# EAGLE design i4screenhsmc (EAGLE 6.6.0)
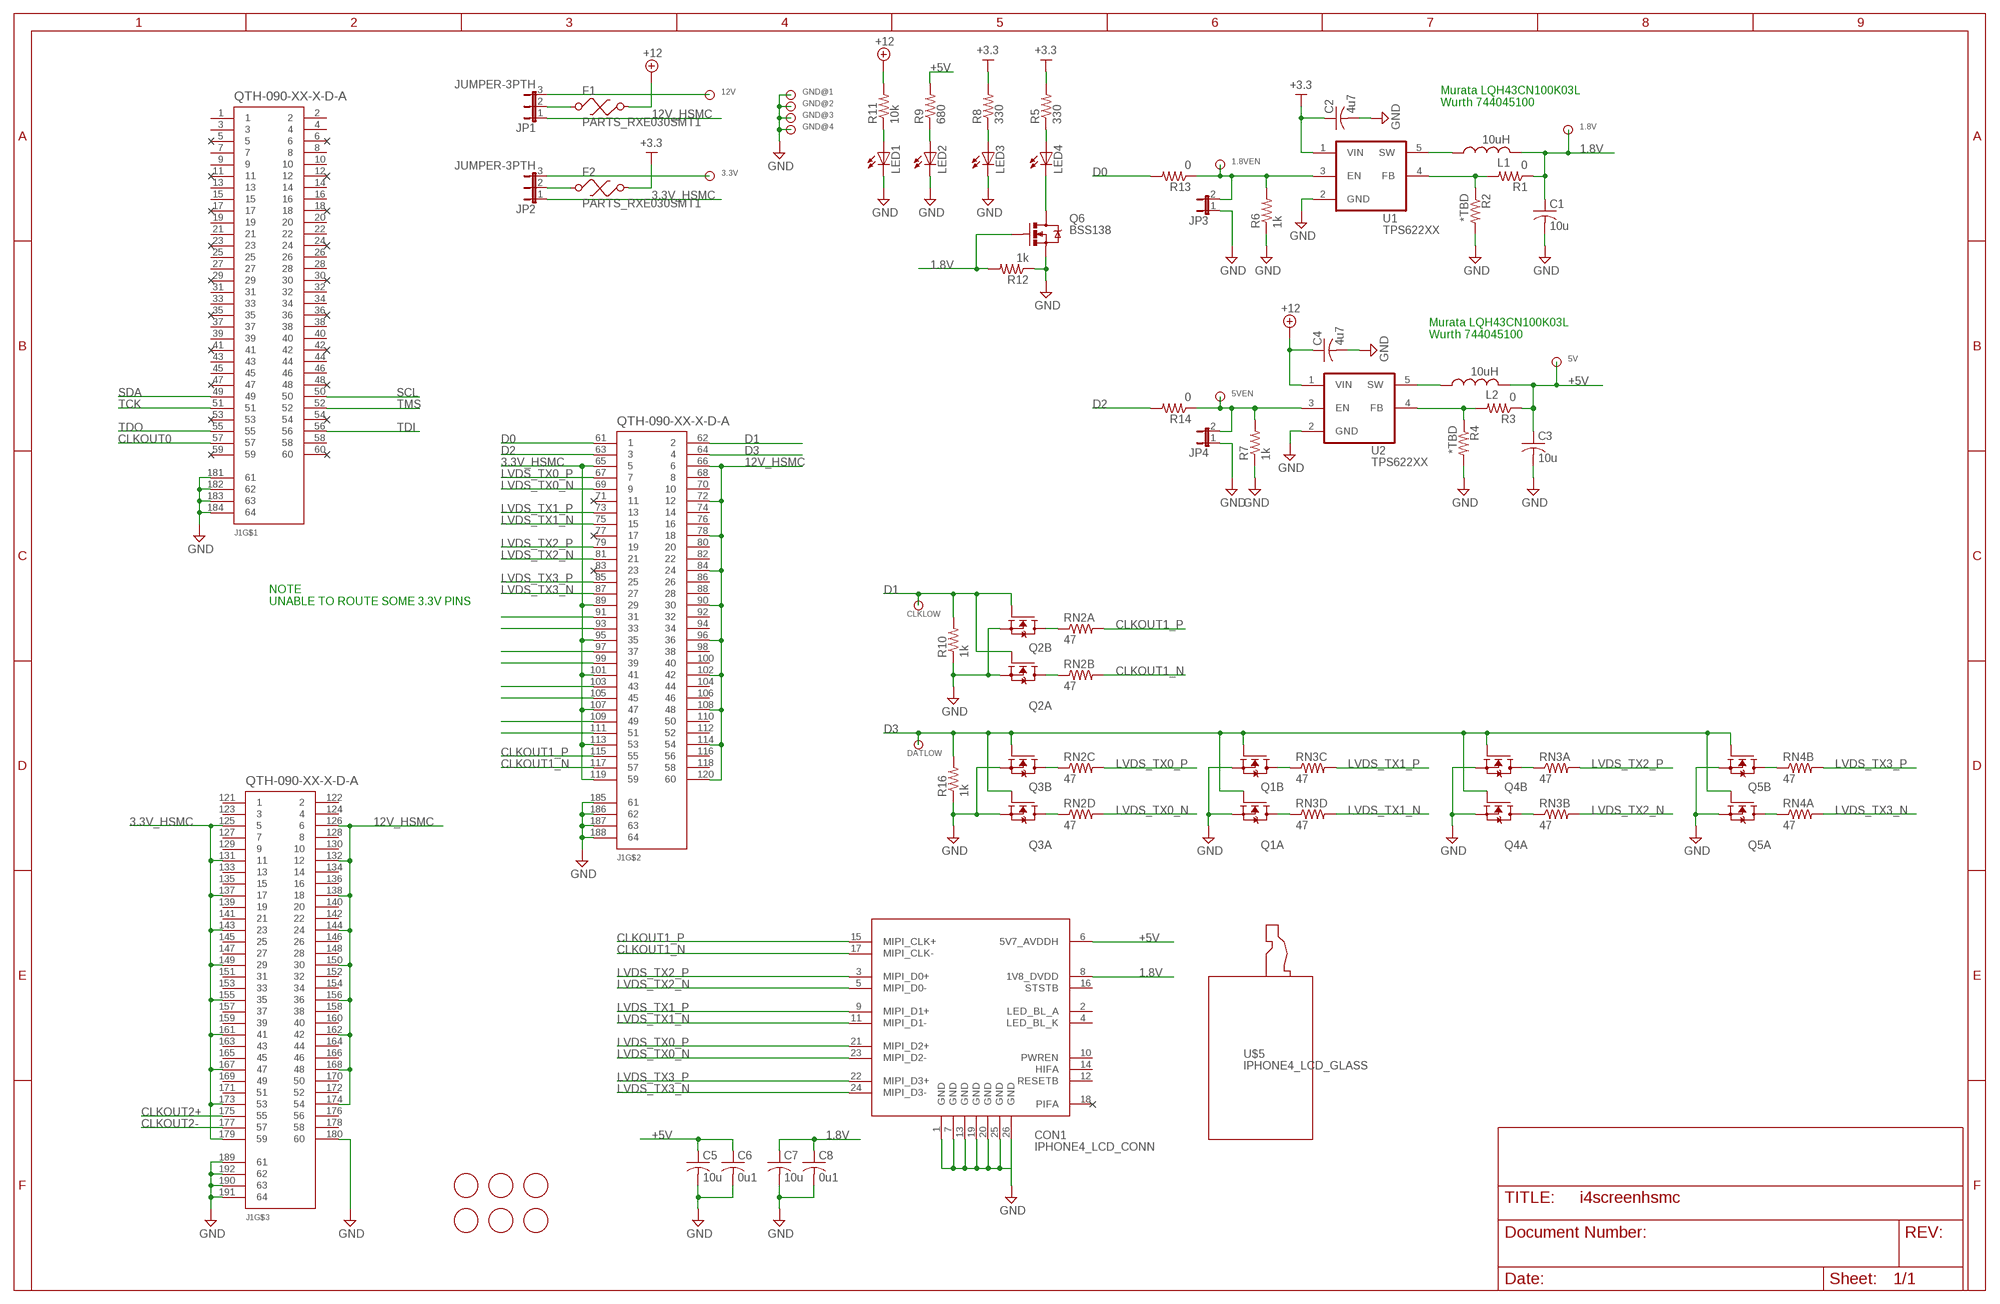
[diagram p0: schematic, sheet 1]

## Parts
1.8V  TESTPOINTKEYSTONE_5015  [5015]
1.8VEN  TESTPOINTKEYSTONE_5016  [5016]
3.3V  TESTPOINTBANANA_JACK  [BANANA_JACK]
5V  TESTPOINTKEYSTONE_5015  [5015]
5VEN  TESTPOINTKEYSTONE_5016  [5016]
12V  TESTPOINTBANANA_JACK  [BANANA_JACK]
C1  10u  C-USC0805  [C0805]
C2  4u7  C-USC0805  [C0805]
C3  10u  C-USC0805  [C0805]
C4  4u7  C-USC0805  [C0805]
C5  10u  C-USC0805  [C0805]
C6  0u1  C-USC0805  [C0805]
C7  10u  C-USC0805  [C0805]
C8  0u1  C-USC0805  [C0805]
CLKLOW  TESTPOINTKEYSTONE_5016  [5016]
CON1  IPHONE4_LCD_CONN  [AXE4E26124]
DATLOW  TESTPOINTKEYSTONE_5016  [5016]
F1  PARTS_RXE030SMT1  [POLYSWITCH_SMTSMALL]
F2  PARTS_RXE030SMT1  [POLYSWITCH_SMTSMALL]
GND@1  TESTPOINTBANANA_JACK  [BANANA_JACK]
GND@2  TESTPOINTBANANA_JACK  [BANANA_JACK]
GND@3  TESTPOINTKEYSTONE_5015  [5015]
GND@4  TESTPOINTKEYSTONE_5015  [5015]
J1  QTH-090-XX-X-D-A  [QTH-090-XX-X-D-A]
JP1  JUMPER-3PTH  [1X03]
JP2  JUMPER-3PTH  [1X03]
JP3  JUMPER-2PTH  [1X02]
JP4  JUMPER-2PTH  [1X02]
L1  10uH  L-USL1812  [L1812]
L2  10uH  L-USL1812  [L1812]
LED1  LEDCHIP-LED0805  [CHIP-LED0805]
LED2  LEDCHIP-LED0805  [CHIP-LED0805]
LED3  LEDCHIP-LED0805  [CHIP-LED0805]
LED4  LEDCHIP-LED0805  [CHIP-LED0805]
Q1  2N7002SC70-6  [SC70-6]
Q2  2N7002SC70-6  [SC70-6]
Q3  2N7002SC70-6  [SC70-6]
Q4  2N7002SC70-6  [SC70-6]
Q5  2N7002SC70-6  [SC70-6]
Q6  BSS138  MOSFET-NCHANNELSMD  [SOT23-3]
R1  0  R-US_R0805  [R0805]
R2  *TBD  R-US_R0805  [R0805]
R3  0  R-US_R0805  [R0805]
R4  *TBD  R-US_R0805  [R0805]
R5  330  R-US_R0805  [R0805]
R6  1k  R-US_R0805  [R0805]
R7  1k  R-US_R0805  [R0805]
R8  330  R-US_R0805  [R0805]
R9  680  R-US_R0805  [R0805]
R10  1k  R-US_R0805  [R0805]
R11  10k  R-US_R0805  [R0805]
R12  1k  R-US_R0805  [R0805]
R13  0  R-US_R0805  [R0805]
R14  0  R-US_R0805  [R0805]
R16  1k  R-US_R0805  [R0805]
RN2  47  RES_NETWORK0805  [2008]
RN3  47  RES_NETWORK0805  [2008]
RN4  47  RES_NETWORK0805  [2008]
U1  TPS622XX  [SOT23-5]
U2  TPS622XX  [SOT23-5]
U$1  MOUNTING_HOLE125  [HOLE_MTG_125]
U$2  MOUNTING_HOLE125  [HOLE_MTG_125]
U$3  MOUNTING_HOLE125  [HOLE_MTG_125]
U$4  MOUNTING_HOLE125  [HOLE_MTG_125]
U$5  IPHONE4_LCD_GLASS  [IPHONE4_LCD]
U$48  MOUNTING_HOLE125  [HOLE_MTG_125]
U$49  MOUNTING_HOLE125  [HOLE_MTG_125]

## Nets
1.8V: 1.8V.P$1 C1.1 C7.1 C8.1 CON1.8(1V8_DVDD) L1.2 Q6.1(G) R1.1 R12.2
3.3V_HSMC: J1.65 J1.89 J1.95 J1.101 J1.107 J1.113 J1.119 J1.125 J1.131 J1.137 J1.143 J1.149 J1.155 J1.161 J1.167 J1.173 J1.179 JP2.1
5VEN: 5VEN.P$1 JP4.2 R7.2 R14.1 U2.3(EN)
12V_HSMC: J1.66 J1.72 J1.78 J1.84 J1.90 J1.96 J1.102 J1.108 J1.114 J1.120 J1.126 J1.132 J1.138 J1.144 J1.150 J1.156 J1.162 J1.168 J1.174 JP1.1
+3.3: C2.1 F2.P$2 R5.2 R8.2 U1.1(VIN)
+5V: 5V.P$1 C3.1 C5.1 C6.1 CON1.6(5V7_AVDDH) L2.2 R3.1 R9.2
+12: C4.1 F1.P$2 R11.2 U2.1(VIN)
CLKOUT0: J1.57
CLKOUT1_N [MIPI]: CON1.17(MIPI_CLK-) J1.117 RN2.7
CLKOUT1_P [MIPI]: CON1.15(MIPI_CLK+) J1.115 RN2.8
CLKOUT2+: J1.175
CLKOUT2-: J1.177
D0: J1.61 R13.2
D1: CLKLOW.P$1 J1.62 Q2.2(B:G) Q2.5(A:G) R10.2
D2: J1.63 R14.2
D3: DATLOW.P$1 J1.64 Q1.2(B:G) Q1.5(A:G) Q3.2(B:G) Q3.5(A:G) Q4.2(B:G) Q4.5(A:G) Q5.2(B:G) Q5.5(A:G) R16.2
GND: C1.2 C2.2 C3.2 C4.2 C5.2 C6.2 C7.2 C8.2 CON1.1(GND) CON1.7(GND) CON1.13(GND) CON1.19(GND) CON1.20(GND) CON1.25(GND) CON1.26(GND) GND@1.1 GND@2.1 GND@3.P$1 GND@4.P$1 J1.180 J1.181 J1.182 J1.183 J1.184 J1.185 J1.186 J1.187 J1.188 J1.189 J1.190 J1.191 J1.192 JP3.1 JP4.1 LED1.C LED2.C LED3.C Q1.1(B:S) Q1.4(A:S) Q2.1(B:S) Q2.4(A:S) Q3.1(B:S) Q3.4(A:S) Q4.1(B:S) Q4.4(A:S) Q5.1(B:S) Q5.4(A:S) Q6.2(S) R2.2 R4.2 R6.1 R7.1 R10.1 R12.1 R16.1 U1.2(GND) U2.2(GND)
LVDS_TX0_N [MIPI]: CON1.23(MIPI_D2-) J1.69 RN2.5
LVDS_TX0_P [MIPI]: CON1.21(MIPI_D2+) J1.67 RN2.6
LVDS_TX1_N [MIPI]: CON1.11(MIPI_D1-) J1.75 RN3.5
LVDS_TX1_P [MIPI]: CON1.9(MIPI_D1+) J1.73 RN3.6
LVDS_TX2_N [MIPI]: CON1.5(MIPI_D0-) J1.81 RN3.7
LVDS_TX2_P [MIPI]: CON1.3(MIPI_D0+) J1.79 RN3.8
LVDS_TX3_N [MIPI]: CON1.24(MIPI_D3-) J1.87 RN4.8
LVDS_TX3_P [MIPI]: CON1.22(MIPI_D3+) J1.85 RN4.7
N$1: 1.8VEN.P$1 JP3.2 R6.2 R13.1 U1.3(EN)
N$2: L1.1 U1.5(SW)
N$3 [MIPI]: J1.91
N$4 [MIPI]: J1.93
N$5 [MIPI]: J1.97
N$6 [MIPI]: J1.99
N$7 [MIPI]: J1.103
N$8 [MIPI]: J1.105
N$9 [MIPI]: J1.109
N$10 [MIPI]: J1.111
N$11: L2.1 U2.5(SW)
N$12: LED4.A R5.1
N$13: Q1.6(B:D) RN3.3
N$14: F2.P$1 JP2.2
N$15: Q1.3(A:D) RN3.4
N$16: Q2.6(B:D) RN2.1
N$17: Q2.3(A:D) RN2.2
N$18: Q3.6(B:D) RN2.3
N$19: Q3.3(A:D) RN2.4
N$20: Q4.6(B:D) RN3.1
N$21: Q4.3(A:D) RN3.2
N$22: F1.P$1 JP1.2
N$23: R1.2 R2.1 U1.4(FB)
N$24: Q5.6(B:D) RN4.2
N$25: Q5.3(A:D) RN4.1
N$26: R3.2 R4.1 U2.4(FB)
N$27: 12V.1 JP1.3
N$28: 3.3V.1 JP2.3
N$29: LED3.A R8.1
N$30: LED2.A R9.1
N$31: LED1.A R11.1
N$32: LED4.C Q6.3(D)
SCL: J1.50
SDA: J1.49
TCK: J1.51
TDI: J1.56
TDO: J1.55
TMS: J1.52
Unconnected: CON1.2(LED_BL_A) CON1.4(LED_BL_K) CON1.10(PWREN) CON1.12(RESETB) CON1.14(HIFA) CON1.16(STSTB) CON1.18(PIFA) J1.1 J1.2 J1.3 J1.4 J1.5 J1.6 J1.7 J1.8 J1.9 J1.10 J1.11 J1.12 J1.13 J1.14 J1.15 J1.16 J1.17 J1.18 J1.19 J1.20 J1.21 J1.22 J1.23 J1.24 J1.25 J1.26 J1.27 J1.28 J1.29 J1.30 J1.31 J1.32 J1.33 J1.34 J1.35 J1.36 J1.37 J1.38 J1.39 J1.40 J1.41 J1.42 J1.43 J1.44 J1.45 J1.46 J1.47 J1.48 J1.53 J1.54 J1.58 J1.59 J1.60 J1.68 J1.70 J1.71 J1.74 J1.76 J1.77 J1.80 J1.82 J1.83 J1.86 J1.88 J1.92 J1.94 J1.98 J1.100 J1.104 J1.106 J1.110 J1.112 J1.116 J1.118 J1.121 J1.122 J1.123 J1.124 J1.127 J1.128 J1.129 J1.130 J1.133 J1.134 J1.135 J1.136 J1.139 J1.140 J1.141 J1.142 J1.145 J1.146 J1.147 J1.148 J1.151 J1.152 J1.153 J1.154 J1.157 J1.158 J1.159 J1.160 J1.163 J1.164 J1.165 J1.166 J1.169 J1.170 J1.171 J1.172 J1.176 J1.178 RN4.3 RN4.4 RN4.5 RN4.6

## Notes on the sheet
- Murata LQH43CN100K03L
  Wurth 744045100
- Murata LQH43CN100K03L
  Wurth 744045100
- NOTE
  UNABLE TO ROUTE SOME 3.3V PINS

## Library data of the parts
1.8V 1.8VEN 3.3V 5V 5VEN 12V CLKLOW DATLOW GND@1-GND@4 = ak-misc:TESTPOINT: Various test points
C1-C8 = rcl:C-US: CAPACITOR, American symbol
CON1 = ak-misc:IPHONE4_LCD_CONN
F1 F2 = bipm:PARTS_RXE030
J1 = QTH-090-XX-X-D-A:QTH-090-XX-X-D-A: HIGH SPEED TERMINAL STRIP, .5mm PITCH, 180 PINS. MANUFACTURER:SAMTEC.
JP1 JP2 = SparkFun:JUMPER-3
JP3 JP4 = SparkFun:JUMPER-2: Jumper Basic 0.1" spaced jumper. Use with breakaway headers.
L1 L2 = rcl:L-US: INDUCTOR, American symbol
LED1-LED4 = led:LED: LED OSRAM: - CHIPLED LG R971, LG N971, LY N971, LG Q971, LY Q971, LO R971, LY R971 LH N974, LH R974 LS Q976, LO Q976, LY Q976 LO Q996 - Hyper CHIPLED LW Q18S LB Q993, LB Q99A, LB R99A - SideLED LS A670, LO A670, LY A670, LG A670, LP A670 LB A673, LV A673, LT A673, LW A673 LH A674 LY A675 LS A676, LA A676, LO A676, LY A676, LW A676 LS A679, LY A679, LG A679 - Hyper Micro SIDELED® LS Y876, LA Y876, LO Y876, LY Y876 LT Y87S - SmartLED LW L88C, LW L88S LB L89C, LB L89S, LG L890 LS L89K, LO L89K, LY L89K LS L896, LA L896, LO L896, LY L896 - TOPLED LS T670, LO T670, LY T670, LG T670, LP T670 LSG T670, LSP T670, LSY T670, LOP T670, LYG T670 LG T671, LOG T671, LSG T671 LB T673, LV T673, LT T673, LW T673 LH T674 LS T676, LA T676, LO T676, LY T676, LB T676, LH T676, LSB T676, LW T676 LB T67C, LV T67C, LT T67C, LS T67K, LO T67K, LY T67K, LW E67C LS E67B, LA E67B, LO E67B, LY E67B, LB E67C, LV E67C, LT E67C LW T67C LS T679, LY T679, LG T679 LS T770, LO T770, LY T770, LG T770, LP T770 LB T773, LV T773, LT T773, LW T773 LH T774 LS E675, LA E675, LY E675, LS T675 LS T776, LA T776, LO T776, LY T776, LB T776 LHGB T686 LT T68C, LB T68C - Hyper Mini TOPLED® LB M676 - Mini TOPLED Santana® LG M470 LS M47K, LO M47K, LY M47K Source: http://www.osram.convergy.de LUXEON: - LUMILED® LXK2-PW12-R00, LXK2-PW12-S00, LXK2-PW14-U00, LXK2-PW14-V00 LXK2-PM12-R00, LXK2-PM12-S00, LXK2-PM14-U00 LXK2-PE12-Q00, LXK2-PE12-R00, LXK2-PE12-S00, LXK2-PE14-T00, LXK2-PE14-U00 LXK2-PB12-K00, LXK2-PB12-L00, LXK2-PB12-M00, LXK2-PB14-N00, LXK2-PB14-P00, LXK2-PB14-Q00 LXK2-PR12-L00, LXK2-PR12-M00, LXK2-PR14-Q00, LXK2-PR14-R00 LXK2-PD12-Q00, LXK2-PD12-R00, LXK2-PD12-S00 LXK2-PH12-R00, LXK2-PH12-S00 LXK2-PL12-P00, LXK2-PL12-Q00, LXK2-PL12-R00 Source: www.luxeon.com KINGBRIGHT: KA-3528ASYC Source: www.kingbright.com
Q1-Q5 = ak-misc:2N7002
Q6 = SparkFun:MOSFET-NCHANNEL
R1-R14 R16 = rcl:R-US_: RESISTOR, American symbol
RN2-RN4 = ak-misc:RES_NETWORK
U1 U2 = ak-misc:TPS622XX
U$1-U$4 U$48 U$49 = ak-misc:MOUNTING_HOLE
U$5 = ak-misc:IPHONE4_LCD_GLASS

## Net classes
1 MIPI: width 0.3 mm, drill 0.3 mm, clearance 0.15 mm

## Board
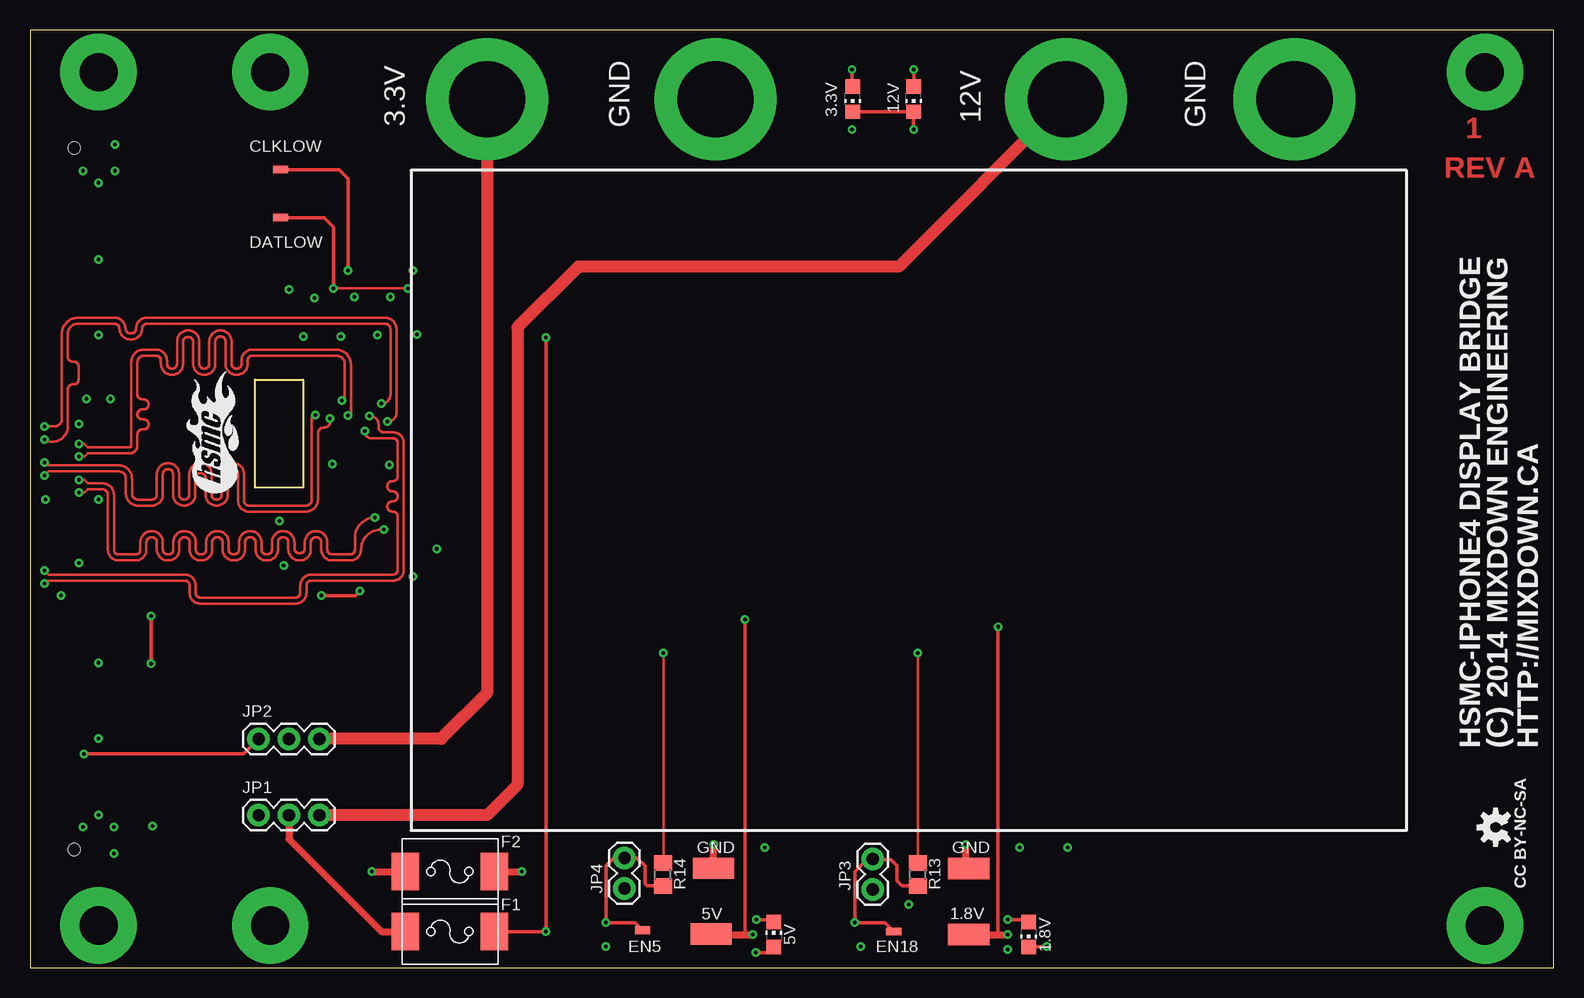
[diagram p1: board, top side]
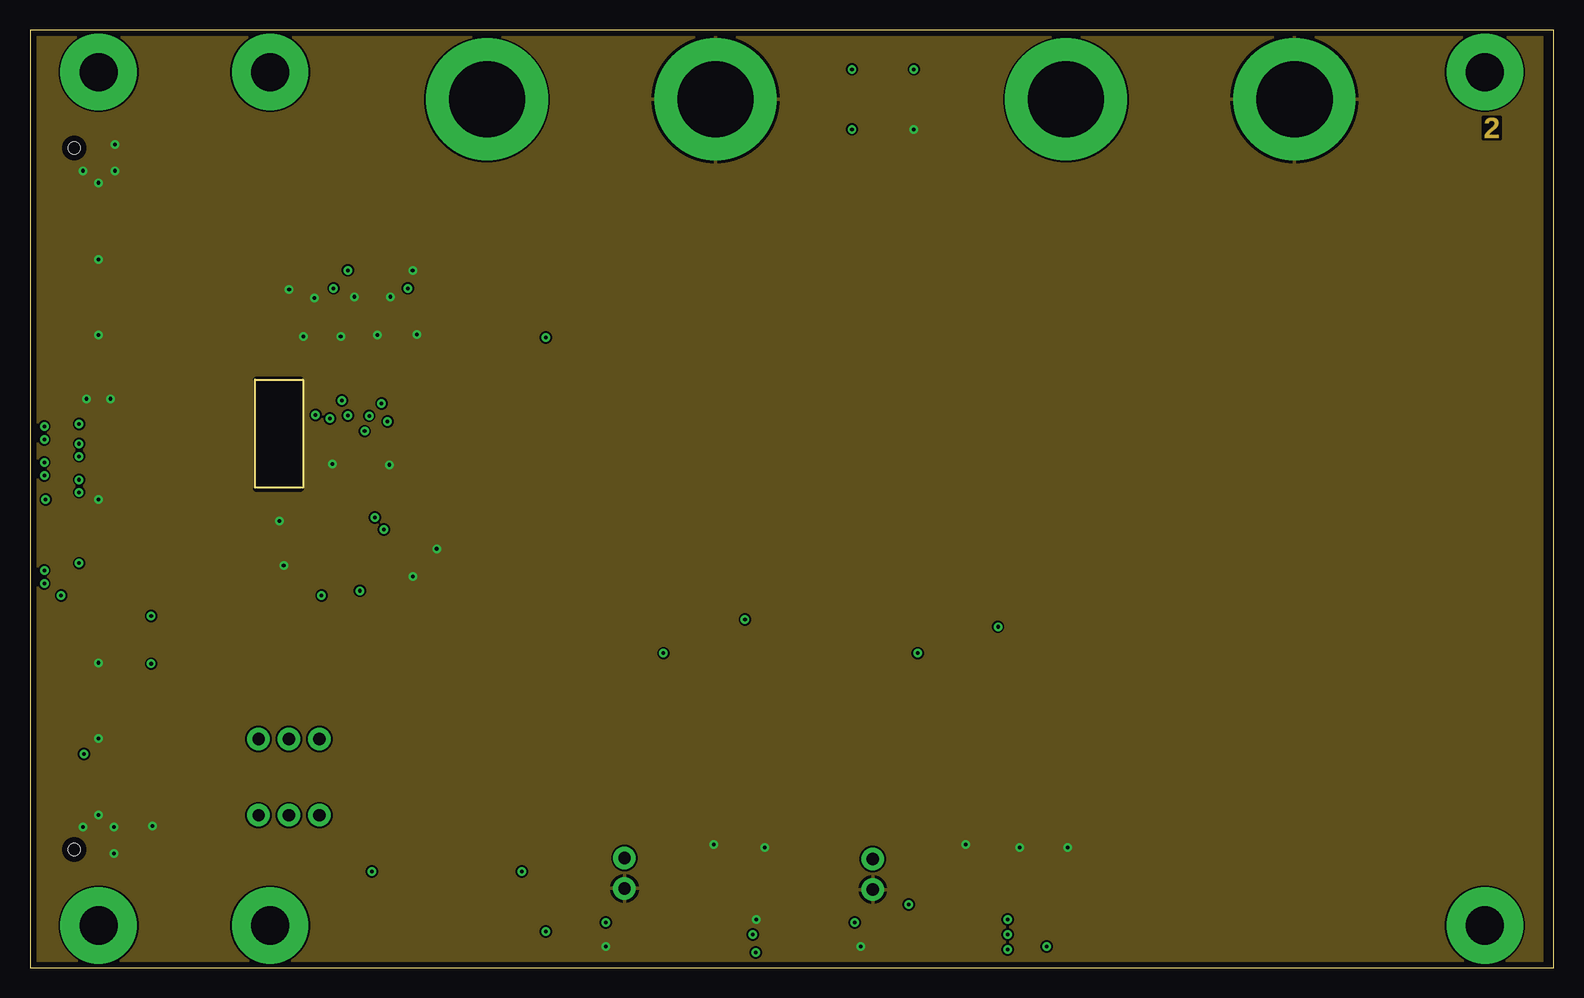
[diagram p2: board, inner layer Route2]
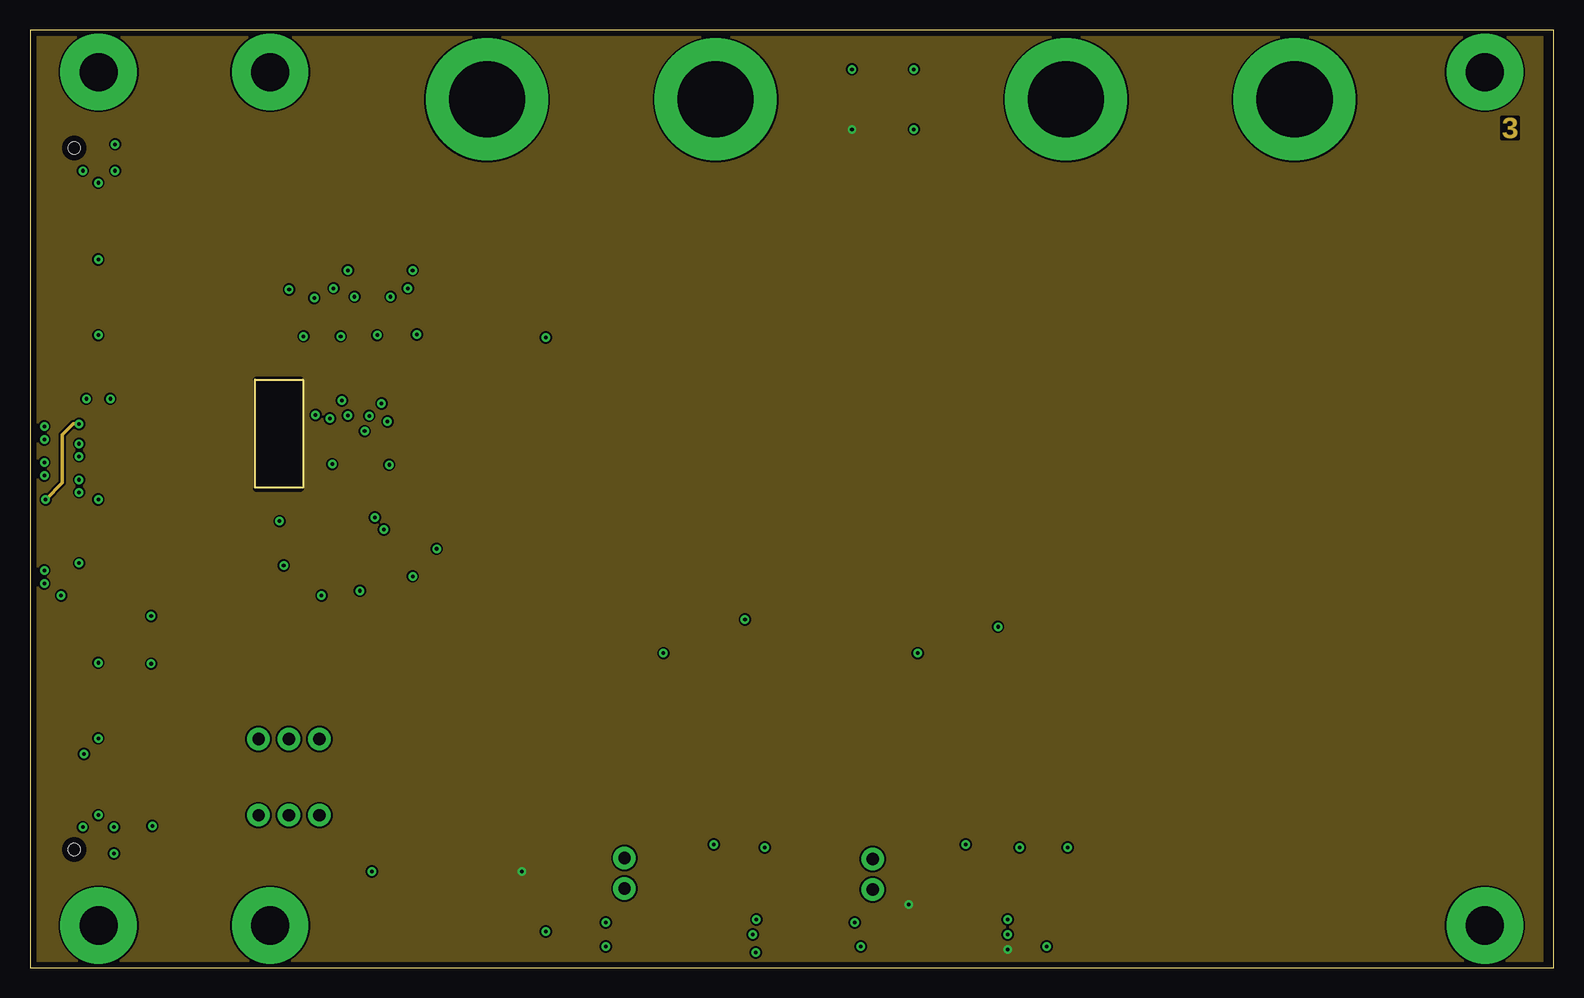
[diagram p3: board, inner layer Route15]
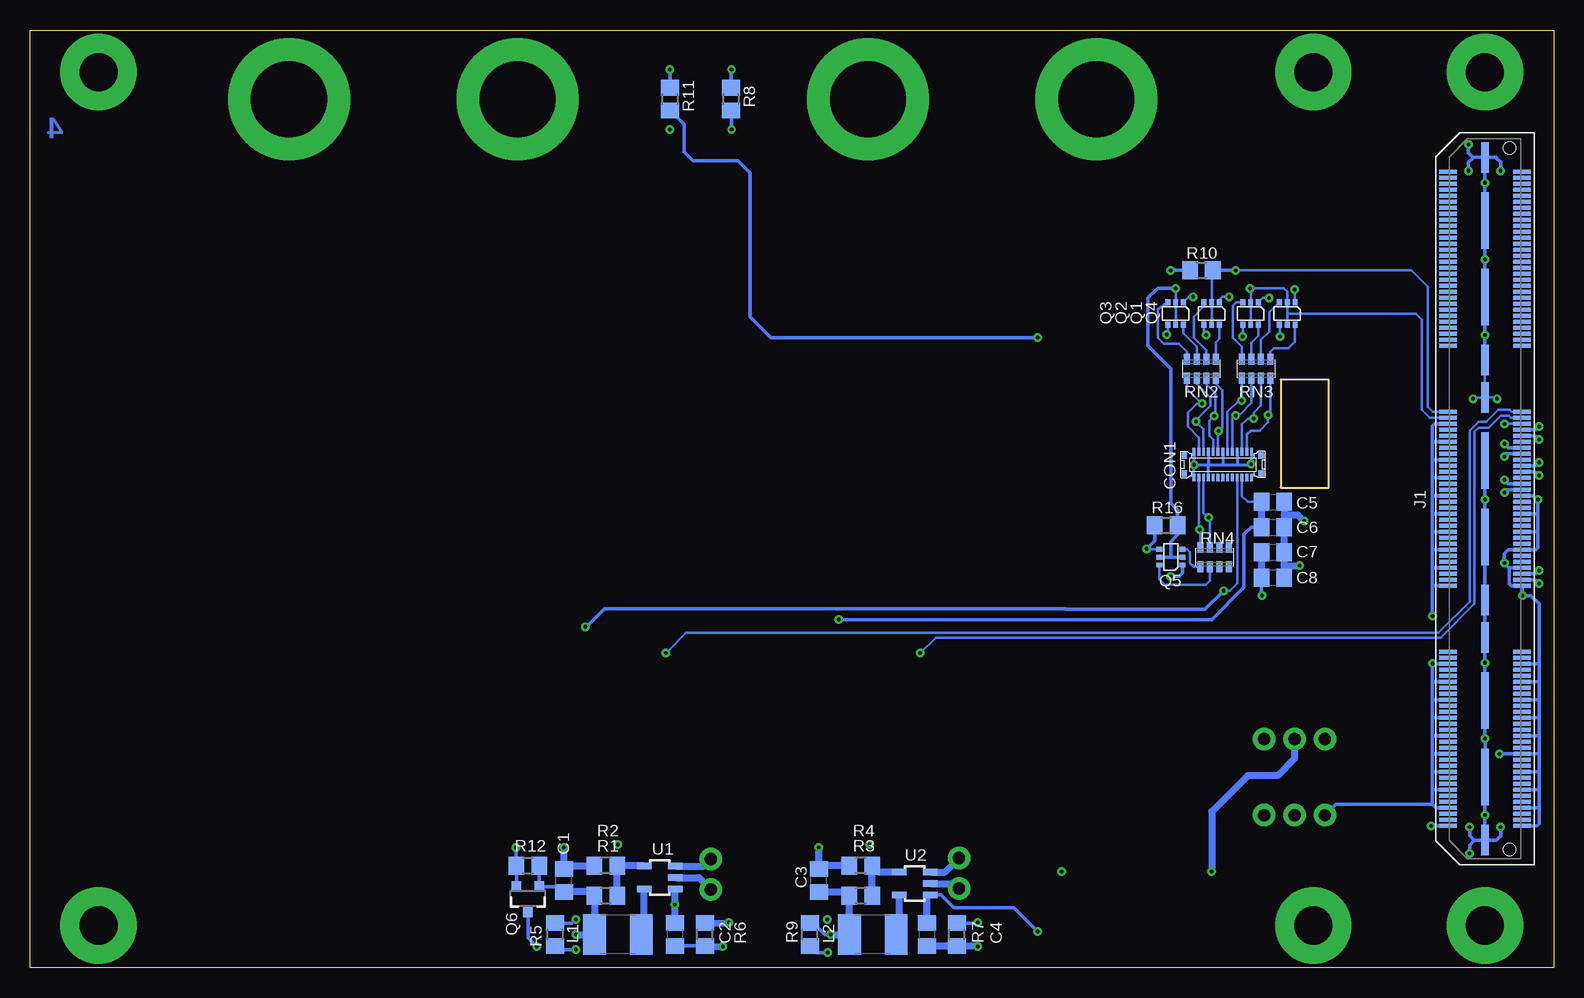
[diagram p4: board, bottom side, seen from below]

Size 127 x 78.13 mm. Coordinates in mm from the lower left corner, seen from the top.
Outline: 0,0 127,0 127,78.13 0,78.13 0,0
Copper layers (1+2*15+16): Top 0.0178mm / dielectric 12mil / Route2 0.0356mm / dielectric 28mil / Route15 0.0356mm / dielectric 12mil / Bottom 0.0178mm
Design rules "ssc-4l-thermals-stopmask-via": minimum track width 6mil, minimum drill 8mil, track to track 6mil, track to pad 6mil, pad to pad 6mil, via to via 6mil, smd to smd 6mil, copper to edge 20mil, drill to drill 16mil, minimum pad ring 8mil, minimum via ring 8mil, stop-mask expansion 3mil, vias tented up to drill 12mil, thermal gap 10mil
tKeepout: area 18.8,40 to 22.8,49
bKeepout: area 0,0 to 23.4,78.1; area 18.8,40 to 22.8,49
Milling: 4 lines

### Footprints (pad centres in the part's own frame; a part is rotated, then mirrored left to right if it is on the bottom)
5015 = smd 3.429 x 1.778: P$1 0,0
5016 = smd 1.27 x 0.635: P$1 0,0
BANANA_JACK = drill 6.35 pad 10.16: 1 0,0
C0805 = smd 1.3 x 1.5: 1 -0.95,0; 2 0.95,0
AXE4E26124 = smd 0.23 x 0.65: 1 2.4,1.075; 2 2.4,-1.075; 3 2,1.075; 4 2,-1.075; 5 1.6,1.075; 6 1.6,-1.075; 7 1.2,1.075; 8 1.2,-1.075; 9 0.8,1.075; 10 0.8,-1.075; 11 0.4,1.075; 12 0.4,-1.075; 13 0,1.075; 14 0,-1.075; 15 -0.4,1.075; 16 -0.4,-1.075; 17 -0.8,1.075; 18 -0.8,-1.075; 19 -1.2,1.075; 20 -1.2,-1.075; 21 -1.6,1.075; 22 -1.6,-1.075; 23 -2,1.075; 24 -2,-1.075; 25 -2.4,1.075; 26 -2.4,-1.075 | smd 0.45 x 0.53: M1 3.2,0.75; M2 3.2,-0.75; M3 -3.2,0.75; M4 -3.2,-0.75
POLYSWITCH_SMTSMALL = smd 2.3 x 3.1: P$1 -3.7,0; P$2 3.7,0
QTH-090-XX-X-D-A = smd 0.3 x 1.45: 1 -27.255,3.09; 2 -27.255,-3.09; 3 -26.755,3.09; 4 -26.755,-3.09; 5 -26.255,3.09; 6 -26.255,-3.09; 7 -25.755,3.09; 8 -25.755,-3.09; 9 -25.255,3.09; 10 -25.255,-3.09; 11 -24.755,3.09; 12 -24.755,-3.09; 13 -24.255,3.09; 14 -24.255,-3.09; 15 -23.755,3.09; 16 -23.755,-3.09; 17 -23.255,3.09; 18 -23.255,-3.09; 19 -22.755,3.09; 20 -22.755,-3.09; 21 -22.255,3.09; 22 -22.255,-3.09; 23 -21.755,3.09; 24 -21.755,-3.09; 25 -21.255,3.09; 26 -21.255,-3.09; 27 -20.755,3.09; 28 -20.755,-3.09; 29 -20.255,3.09; 30 -20.255,-3.09; 31 -19.755,3.09; 32 -19.755,-3.09; 33 -19.255,3.09; 34 -19.255,-3.09; 35 -18.755,3.09; 36 -18.755,-3.09; 37 -18.255,3.09; 38 -18.255,-3.09; 39 -17.755,3.09; 40 -17.755,-3.09; 41 -17.255,3.09; 42 -17.255,-3.09; 43 -16.755,3.09; 44 -16.755,-3.09; 45 -16.255,3.09; 46 -16.255,-3.09; 47 -15.755,3.09; 48 -15.755,-3.09; 49 -15.255,3.09; 50 -15.255,-3.09; 51 -14.755,3.09; 52 -14.755,-3.09; 53 -14.255,3.09; 54 -14.255,-3.09; 55 -13.755,3.09; 56 -13.755,-3.09; 57 -13.255,3.09; 58 -13.255,-3.09; 59 -12.755,3.09; 60 -12.755,-3.09; 61 -7.255,3.09; 62 -7.255,-3.09; 63 -6.755,3.09; 64 -6.755,-3.09; 65 -6.255,3.09; 66 -6.255,-3.09; 67 -5.755,3.09; 68 -5.755,-3.09; 69 -5.255,3.09; 70 -5.255,-3.09; 71 -4.755,3.09; 72 -4.755,-3.09; 73 -4.255,3.09; 74 -4.255,-3.09; 75 -3.755,3.09; 76 -3.755,-3.09; 77 -3.255,3.09; 78 -3.255,-3.09; 79 -2.755,3.09; 80 -2.755,-3.09; 81 -2.255,3.09; 82 -2.255,-3.09; 83 -1.755,3.09; 84 -1.755,-3.09; 85 -1.255,3.09; 86 -1.255,-3.09; 87 -0.755,3.09; 88 -0.755,-3.09; 89 -0.255,3.09; 90 -0.255,-3.09; 91 0.245,3.09; 92 0.245,-3.09; 93 0.745,3.09; 94 0.745,-3.09; 95 1.245,3.09; 96 1.245,-3.09; 97 1.745,3.09; 98 1.745,-3.09; 99 2.245,3.09; 100 2.245,-3.09; 101 2.745,3.09; 102 2.745,-3.09; 103 3.245,3.09; 104 3.245,-3.09; 105 3.745,3.09; 106 3.745,-3.09; 107 4.245,3.09; 108 4.245,-3.09; 109 4.745,3.09; 110 4.745,-3.09; 111 5.245,3.09; 112 5.245,-3.09; 113 5.745,3.09; 114 5.745,-3.09; 115 6.245,3.09; 116 6.245,-3.09; 117 6.745,3.09; 118 6.745,-3.09; 119 7.245,3.09; 120 7.245,-3.09; 121 12.745,3.09; 122 12.745,-3.09; 123 13.245,3.09; 124 13.245,-3.09; 125 13.745,3.09; 126 13.745,-3.09; 127 14.245,3.09; 128 14.245,-3.09; 129 14.745,3.09; 130 14.745,-3.09; 131 15.245,3.09; 132 15.245,-3.09; 133 15.745,3.09; 134 15.745,-3.09; 135 16.245,3.09; 136 16.245,-3.09; 137 16.745,3.09; 138 16.745,-3.09; 139 17.245,3.09; 140 17.245,-3.09; 141 17.745,3.09; 142 17.745,-3.09; 143 18.245,3.09; 144 18.245,-3.09; 145 18.745,3.09; 146 18.745,-3.09; 147 19.245,3.09; 148 19.245,-3.09; 149 19.745,3.09; 150 19.745,-3.09; 151 20.245,3.09; 152 20.245,-3.09; 153 20.745,3.09; 154 20.745,-3.09; 155 21.245,3.09; 156 21.245,-3.09; 157 21.745,3.09; 158 21.745,-3.09; 159 22.245,3.09; 160 22.245,-3.09; 161 22.745,3.09; 162 22.745,-3.09; 163 23.245,3.09; 164 23.245,-3.09; 165 23.745,3.09; 166 23.745,-3.09; 167 24.245,3.09; 168 24.245,-3.09; 169 24.745,3.09; 170 24.745,-3.09; 171 25.245,3.09; 172 25.245,-3.09; 173 25.745,3.09; 174 25.745,-3.09; 175 26.245,3.09; 176 26.245,-3.09; 177 26.745,3.09; 178 26.745,-3.09; 179 27.245,3.09; 180 27.245,-3.09 | smd 2.54 x 0.64: 181 -28.445,0; 184 -11.555,0; 185 -8.445,0; 188 8.445,0; 189 11.555,0; 192 28.445,0 | smd 4.7 x 0.64: 182 -23.175,0; 183 -16.825,0; 186 -3.175,0; 187 3.175,0; 190 16.825,0; 191 23.175,0 | hole 1.02: -29.24,2.03; 29.24,2.03
1X03 = drill 1.016 pad 1.88: 1 0,0; 2 2.54,0; 3 5.08,0
1X02 = drill 1.016 pad 1.88: 1 0,0; 2 2.54,0
L1812 = smd 1.9 x 3.4: 1 -1.95,0; 2 1.95,0
CHIP-LED0805 = smd 1.2 x 1.2: A 0,-1.05; C 0,1.05
SC70-6 = smd 0.5 x 0.4: 1 -0.95,0.65; 2 -0.95,0; 3 -0.95,-0.65; 4 0.95,-0.65; 5 0.95,0; 6 0.95,0.65
SOT23-3 = smd 0.8 x 0.9: 1 -0.95,-1; 2 0.95,-1; 3 0,1.1
R0805 = smd 1.3 x 1.5: 1 -0.95,0; 2 0.95,0
2008 = smd 0.5 x 0.9: 1 -1.2,-0.8; 2 -0.4,-0.8; 3 0.4,-0.8; 4 1.2,-0.8; 5 1.2,0.8; 6 0.4,0.8; 7 -0.4,0.8; 8 -1.2,0.8
SOT23-5 = smd 0.55 x 1.2: 1 -0.95,-1.3; 2 0,-1.3; 3 0.95,-1.3; 4 0.95,1.3; 5 -0.95,1.3
HOLE_MTG_125 = drill 3.175 pad 6.35: P$1 0,0

### Placement (x,y rotation side)
1.8V  78.25,2.75 0 top
1.8VEN  72,3 0 top
3.3V  38.1,72.35 0 top
5V  56.78,2.79 180 top
5VEN  51.06,3.11 0 top
12V  86.36,72.35 0 top
C1  82.5,7.25 90 bottom
C2  73.25,2.75 270 bottom
C3  61.25,7.25 90 bottom
C4  52.25,2.75 270 bottom
C5  23.4,38.8 0 bottom
C6  23.4,36.7 0 bottom
C7  23.4,34.6 0 bottom
C8  23.4,32.5 0 bottom
CLKLOW  20.9,66.5 0 top
CON1  27.57,41.91 0 bottom
DATLOW  20.9,62.5 0 top
F1  35,3 0 top
F2  35,8 0 top
GND@1  105.41,72.35 0 top
GND@2  57.15,72.35 0 top
GND@3  56.99,8.27 0 top
GND@4  78.25,8.25 0 top
J1  5.71,39.07 270 bottom
JP1  19.05,12.7 0 top
JP2  19.05,19.05 0 top
JP3  70.25,6.5 90 top
JP4  49.56,6.59 90 top
L1  78,2.75 180 bottom
L2  56.75,2.75 180 bottom
LED1  73.66,72.37 180 top
LED2  62,2.75 0 top
LED3  68.58,72.37 180 top
LED4  83.25,2.75 180 top
Q1  25.25,54.5 270 bottom
Q2  28.5,54.5 270 bottom
Q3  31.5,54.5 270 bottom
Q4  22.2,54.5 270 bottom
Q5  31.9,34.2 180 bottom
Q6  85.5,5.75 180 bottom
R1  79,6 0 bottom
R2  79,8.5 180 bottom
R3  57.75,6 0 bottom
R4  57.75,8.5 180 bottom
R5  83.25,2.75 270 bottom
R6  70.75,2.75 90 bottom
R7  49.75,2.75 90 bottom
R8  68.58,72.37 270 bottom
R9  62,2.75 90 bottom
R10  29.35,58.1 0 bottom
R11  73.66,72.37 270 bottom
R12  85.5,8.5 0 bottom
R13  74,7.75 90 top
R14  52.75,7.75 90 top
R16  32.3,36.85 0 bottom
RN2  29.35,49.9 180 bottom
RN3  24.8,49.9 180 bottom
RN4  28.25,34.2 0 bottom
U1  74.5,7.5 90 bottom
U2  53.25,7 90 bottom
U$1  5.71,3.51 0 top
U$2  5.71,74.63 0 top
U$3  20.02,3.51 0 top
U$4  20.02,74.63 0 top
U$5  31.75,11.43 0 top
U$48  121.28,3.51 0 top
U$49  121.28,74.63 0 top

### Tracks (layer width: path | path; a pad name or v marks a point on that pad's centre or on a via)
1.8V  (via drill 0.3)
  Top 0.3: v80.7,28.4 80.7,2.75 80.6,2.75
  Top 0.305: v24.3,31 27.1,31 v27.5,31.4
  Top 0.6: 1.8V.P$1 80.6,2.75 v81.5,2.75
  Bottom 0.2: CON1.8 26.37,32.03 27,31.4 v27.5,31.4
  Bottom 0.3: 82.52,6.28 C1.1 82.95,6.75 Q6.1 R12.2 | v80.7,28.4 80.6,28.4 79.1,29.9 40.7,29.9 40.65,29.85 29.05,29.85 v27.5,31.4 | C8.1 24.35,31.05 v24.3,31
  Bottom 0.6: C1.1 80.25,6.3 R1.1 L1.2 v81.5,2.75 | C7.1 C8.1
3.3V_HSMC  (via drill 0.3)
  Top 0.3: JP2.1 17.8,17.8 v4.5,17.8
  Route15 0.3: v4.1,45.3 3.6,45.3 2.7,44.4 2.7,40.4 v1.3,39
  Bottom 0.2: v4.1,45.3 2.65,45.3 J1.65
  Bottom 0.3: J1.113 3.72,33.32 | 3.72,33.32 v4.1,33.7 4.1,34.5 3.78,34.82 J1.107 1.48,34.82 1.3,35 1.3,36.3 | J1.179 1.38,11.82 1.2,12 1.2,13.32 | 1.2,13.32 1.2,14.82 | 1.2,14.82 1.2,16.32 | 1.2,16.32 1.2,17.82 | 1.2,17.82 1.2,19.32 | 1.2,19.32 1.2,20.82 | 1.2,20.82 1.2,22.32 | 1.2,22.32 1.2,23.82 | J1.173 1.2,13.32 | J1.167 1.2,14.82 | J1.161 1.2,16.32 | 1.2,17.82 J1.155 4.48,17.82 v4.5,17.8 | J1.149 1.2,19.32 | J1.143 1.2,20.82 | J1.137 1.2,22.32 | J1.131 1.2,23.82 | 1.2,23.82 1.2,25.32 | 1.2,25.32 1.2,30.3 1.9,31 v2.6,31 2.62,31.02 J1.119 3.52,31.82 3.7,32 3.7,33.3 3.72,33.32 | 1.3,36.3 1.3,37.8 | 1.3,37.8 1.3,38.9 | 1.3,38.9 1.72,39.32 J1.89 | J1.101 2.6,36.3 1.3,36.3 | J1.95 2.6,37.8 1.3,37.8 | 1.3,38.9 v1.3,39 | J1.125 1.2,25.32
5VEN  (via drill 0.3)
  Top 0.3: R14.1 51.45,6.8 51.25,7 51.25,8.5 50.62,9.13 JP4.2 48.63,9.13 48,8.5 v48,3.75 50.1,3.75 50.42,3.75 5VEN.P$1
  Bottom 0.3: R7.2 48.05,3.7
  Bottom 0.6: U2.3 50.74,7.95 JP4.2 | 48.05,3.7 v48,3.75
12V_HSMC  (via drill 0.3)
  Top 0.3: v10.1,25.32 v10.1,29.3
  Bottom 0.3: J1.174 9.82,13.32 10.1,13.6 | 10.1,13.6 10.1,14.82 | 10.1,14.82 10.1,16.32 | 10.1,16.32 10.1,17.82 | 10.1,17.82 10.1,19.32 | 10.1,19.32 10.1,20.82 | 10.1,20.82 10.1,22.32 | 10.1,22.32 10.1,23.82 | 9.78,25.32 J1.126 v10.1,25.32 10.1,23.82 | J1.168 10.1,14.82 | J1.162 10.1,16.32 | J1.156 10.1,17.82 | J1.150 10.1,19.32 | J1.144 10.1,20.82 | J1.138 10.1,22.32 | J1.132 10.1,23.82 | 10.1,31.82 10.1,33.32 | 10.1,33.32 10.1,34.82 | 10.1,34.82 10.1,36.32 | 10.1,36.32 10.1,37.82 | 10.1,37.82 10.1,39.32 | 10.1,39.32 10.1,40.82 | 10.1,40.82 10.1,42.32 | 10.1,42.32 10.1,43.8 | 10.1,43.8 10.1,45.1 9.88,45.32 J1.66 | JP1.1 18.15,13.6 10.1,13.6 | J1.72 8.82,43.8 10.1,43.8 | J1.78 10.1,42.32 | J1.84 10.1,40.82 | J1.90 10.1,39.32 | J1.96 10.1,37.82 | J1.102 10.1,36.32 | J1.108 10.1,34.82 | J1.114 10.1,33.32 | J1.120 10.1,31.82 | 10.1,31.82 v10.1,29.3
+3.3  (via drill 0.3)
  Top 0.6: F2.P$2 v41,8
  Bottom 0.3: R8.2 68.52,71.36 v68.52,69.85 | R5.2 82.95,1.5 v81.5,1.5
  Bottom 0.6: C2.1 v73.25,5.25 73.25,6.5 U1.1
  pour Route15: 0,0 126,0 126,78 0,78
+5V  (via drill 0.3)
  Top 0.3: 5V.P$1 56.82,2.75 | v59.6,29 59.6,2.75
  Top 0.6: 56.82,2.75 59.6,2.75 v60.25,2.75
  Bottom 0.2: CON1.6 25.97,39.27 25.5,38.8 C5.1
  Bottom 0.3: R9.2 61.8,3.5 61.5,3.5 60.75,2.75 v60.25,2.75 | v59.6,29 28.5,29 25.8,31.7 25.8,36.1 25.2,36.7 C6.1
  Bottom 0.6: C3.1 59,6.3 R3.1 L2.2 v60.25,2.75 | C5.1 C6.1
+12  (via drill 0.3)
  Top 0.3: v43,52.5 v43,3 F1.P$2
  Bottom 0.3: U2.1 51.05,6.05 50,5 45,5 v43,3 | v43,52.5 65.25,52.5 67,54.25 67,66.25 68,67.25 71.75,67.25 72.5,68 72.5,70.26 R11.2
  Bottom 0.6: C4.1 52.25,6.05 U2.1
CLKOUT1_N  (via drill 0.3)
  Top 0.203: v1.2,32 1.45,32.25 5,32.25 4.7,32.25 11.49,32.25 12.9,32.25 arc-90 13.3,31.84 13.3,31.23 arc90 14.21,30.33 22.14,30.33 arc90 23.04,31.23 23.04,31.84 arc-90 23.45,32.25 27.31,32.25 | 27.3,32.25 27.35,32.25 27.31,32.25 | 27.31,32.25 30.3,32.25 arc90 31.15,33.1 31.15,43.75 arc90 30.3,44.6 29.5,44.6 arc-90 29.05,45.05 29.05,45.25 arc90 28.32,45.98 v28.28,45.98 | 27.3,32.25 27.31,32.25 | 27.31,32.25 arc90 27.31,32.25
  Bottom 0.15: 28.3,46 v28.28,45.98 28.2,46.06
  Bottom 0.2: CON1.17 28.37,43.97 28.7,44.3 28.7,45.56 v28.28,45.98 | RN2.7 28.95,48.6 28.2,47.85 28.2,46.06
  Bottom 0.3: J1.117 1.52,32.32 v1.2,32
CLKOUT1_P  (via drill 0.3)
  Top 0.203: v1.2,33.1 1.55,32.75 4.95,32.75 4.75,32.75 10.42,32.75 12.9,32.75 arc-90 13.81,31.84 13.81,31.23 arc90 14.21,30.83 22.14,30.83 arc90 22.54,31.23 22.54,31.84 arc-90 23.45,32.75 27.31,32.75 27.35,32.75 | 27.35,32.75 27.3,32.75 | 27.35,32.75 30.3,32.75 arc90 30.65,33.1 30.65,37.6 arc90 30.24,38 30.19,38 arc-90 29.79,38.41 29.79,38.44 arc-90 30.19,38.84 30.24,38.84 arc90 30.65,39.25 30.65,39.28 arc90 30.24,39.69 30.19,39.69 arc-90 29.79,40.09 29.79,40.12 arc-90 30.19,40.53 30.24,40.53 arc90 30.65,40.93 30.65,43.75 arc90 30.3,44.1 28.5,44.1 arc-90 v27.9,44.7
  Bottom 0.15: 27.97,44.63 v27.9,44.7
  Bottom 0.2: CON1.15 27.97,44.63 | RN2.8 28.15,48.65 27.6,48.1 27.6,45 v27.9,44.7
  Bottom 0.3: J1.115 1.48,32.82 v1.2,33.1
D0  (via drill 0.3)
  Top 0.2: v74,26.2 R13.2
  Bottom 0.2: J1.61 3.47,46.32 3.65,46.5 4.6,46.5 5.6,45.5 6.25,45.5 7,44.75 7,30.5 9.6,27.9 72.3,27.9 v74,26.2
D1  (via drill 0.3)
  Top 0.3: CLKLOW.P$1 25.75,66.5 26.5,65.75 v26.5,58.1
  Bottom 0.2: Q2.5 Q2.2 28.5,58 R10.2 | J1.62 10.07,46.32 10.5,46.75 10.5,56.75 11.85,58.1 v26.5,58.1
  Bottom 0.3: R10.2 v26.5,58.1
D2  (via drill 0.3)
  Top 0.2: v52.8,26.2 52.8,8.75 R14.2
  Bottom 0.2: J1.63 3.57,45.82 3.75,46 4.4,46 5.4,45 6.25,45 6.6,44.65 6.6,30.3 9.4,27.5 51.5,27.5 v52.8,26.2
D3  (via drill 0.3)
  Top 0.2: v25.3,56.6 v31.5,56.6
  Top 0.3: DATLOW.P$1 24.5,62.5 25.3,61.7 v25.3,56.6
  Bottom 0.15: 25.25,56.55 v25.3,56.6
  Bottom 0.2: Q1.5 Q1.2 25.25,56.55 | Q3.5 Q3.2 v31.5,56.6 | v25.3,56.6 22.5,56.6 22.2,56.3 Q4.2 22.2,54.5 | 22.2,54.5 Q4.5 | J1.64 10.32,45.82 11,46.5 11,54 11.5,54.5 22.2,54.5
  Bottom 0.3: Q5.2 31.9,34.2 | 31.9,34.2 Q5.5 | 31.9,34.2 31.9,35.5 31.35,36.05 R16.2 31.35,38.15 31.9,38.7 31.9,49.9 33.8,51.8 33.8,55.8 33,56.6 v31.5,56.6
GND  (via drill 0.3)
  Top 0.3: v73.68,69.85 73.66,69.85 LED1.C LED3.C | LED2.C 61.8,4 v60.55,4
  Top 0.6: GND@3.P$1 v56.99,10.24 v57,10.25 | GND@4.P$1 78,8.5 v78,10.25
  Bottom 0.15: Q4.4 22.8,53.5 | Q2.1 27.85,55.65
  Bottom 0.2: Q3.4 32.15,52.85 v32.25,52.75 | Q2.4 29.15,52.9 v28.95,52.7 | 22.8,53.5 v22.8,52.6 | Q4.1 21.55,56.45 v21.6,56.5 | Q1.4 v25.9,52.6 | Q3.1 30.4,55.9 v30.05,55.9 | 27.85,55.65 27.6,55.9 v27.05,55.9 | Q1.1 24.25,55.8 v23.7,55.8 | Q5.4 33.85,34.85 v33.9,34.9 | v4.7,47.4 4.81,47.51 J1.185 J1.184 | v6.7,47.4 6.6,47.5 J1.185
  Bottom 0.254: CON1.7 26.37,41.92 | CON1.13 27.57,41.92 | 27.57,41.92 26.37,41.92 | CON1.19 28.77,41.92 | 28.77,41.92 27.57,41.92 | CON1.25 29.97,41.92 | 29.97,41.92 28.77,41.92 | 26.37,41.92 25.2,41.92 v25.2,41.95 25.17,41.98 CON1.1 | CON1.26 29.97,41.8 | 29.97,41.8 29.97,41.92 | CON1.20 28.77,41.92 | v29.95,41.9 29.95,41.82 29.97,41.8
  Bottom 0.3: J1.181 J1.182 J1.183 J1.184 | J1.186 J1.187 J1.188 J1.189 J1.190 5.7,16.6 J1.191 J1.192 6.62,10.62 7,11 v7,11.7 | J1.180 10.08,11.82 v10.2,11.8 | 6.6,10.6 7,10.2 v7,9.5 | 5.82,67.52 6.7,67.52 | v7.1,68.6 7.1,67.9 6.72,67.52 6.7,67.52 | v7.1,66.4 7.1,67.1 6.7,67.5 6.7,67.52 | R16.1 33.25,35.55 v33.9,34.9 | R10.1 v31.9,58.1 | Q5.1 30.95,32.85 31.2,32.6 v31.9,32.6 | Q6.2 R12.1 86.5,8.55 v86.5,10 | C2.2 R6.1 | 5.68,10.62 4.78,10.62 4.4,11 v4.4,11.7 | 5.68,67.52 4.78,67.52 4.8,67.5 4.4,67.1 v4.4,66.4
  Bottom 0.6: U2.2 49.97,7 JP4.1 | C4.2 R7.1 48.05,1.8 v48,1.75 | v61.25,10 C3.2 60.95,8.5 R4.2 | R2.2 82.2,8.5 C1.2 v82.5,10 | U1.2 71.25,7.5 JP3.1 | R6.1 v69.25,1.75 | C5.2 22.45,37.7 | 22.45,37.7 C6.2 C7.2 C8.2 | 22.45,37.7 21.3,37.7 v20.8,37.2 | 22.4,33.5 v21.15,33.5
  other vias: 5.7,65.4 5.7,59 5.7,52.7 5.7,39 5.7,25.4 5.7,19.1 5.7,12.7
  pour Route2: 0,0 126,0 126,78 0,78
LVDS_TX0_N  (via drill 0.3)
  Top 0.203: v1.2,44 arc121 3.15,45.1 3.15,48.19 arc-90 3.56,48.6 3.65,48.6 arc90 4.05,49 4.05,50.09 arc90 3.65,50.5 3.56,50.5 arc-90 3.15,50.9 3.15,52.8 arc-90 4,53.65 7.05,53.65 arc-90 7.46,53.24 arc90 8.36,52.34 8.44,52.34 arc90 9.35,53.24 arc-90 9.75,53.65 29.6,53.65 arc-90 30.05,53.2 30.05,47.75 arc-90 v29.3,47
  Bottom 0.2: CON1.23 29.57,44.17 30.5,45.1 30.5,46.25 29.75,47 v29.3,47 30.55,48.25 RN2.5
  Bottom 0.3: J1.69 1.52,44.32 v1.2,44
LVDS_TX0_P  (via drill 0.3)
  Top 0.203: v1.2,45.1 2.05,45.1 arc90 2.65,45.7 2.65,52.8 arc-90 4,54.15 7.05,54.15 arc-90 7.96,53.24 arc90 8.36,52.84 8.44,52.84 arc90 8.84,53.24 arc-90 9.75,54.15 29.6,54.15 arc-90 30.55,53.2 30.55,46.25 arc-90 v29.8,45.5
  Bottom 0.15: 29.8,45.6 v29.8,45.5
  Bottom 0.2: CON1.21 29.17,44.87 v29.8,45.5 | RN2.6 29.75,48.65 28.6,47.5 28.6,46.8 29.8,45.6
  Bottom 0.3: J1.67 1.48,44.82 v1.2,45.1
LVDS_TX1_N  (via drill 0.3)
  Top 0.203: v4.1,42.6 4.55,42.6 4.8,42.85 8.3,42.85 arc90 8.95,43.5 8.95,44.44 arc-90 9.36,44.85 9.48,44.85 arc90 9.89,45.25 9.89,45.28 arc90 9.48,45.68 9.36,45.68 arc-90 8.95,46.08 8.95,46.11 arc-90 9.36,46.51 9.48,46.51 arc90 9.89,46.92 9.89,46.94 arc90 9.48,47.35 9.36,47.35 arc-90 8.95,47.75 8.95,50.45 arc-90 9.5,51 10.51,51 arc-90 10.91,50.59 10.91,50.31 arc90 11.82,49.41 11.86,49.41 arc90 12.76,50.31 12.76,52.14 arc-90 13.17,52.55 13.2,52.55 arc-90 13.61,52.14 13.61,50.31 arc90 14.51,49.41 14.55,49.41 arc90 15.45,50.31 15.45,52.19 arc-90 15.86,52.59 15.89,52.59 arc-90 16.3,52.19 16.3,50.31 arc90 17.2,49.41 17.24,49.41 arc90 18.15,50.31 18.15,50.59 arc-90 18.55,51 25.5,51 arc-90 26.25,50.25 26.25,47.5 arc-90 v26,47.25
  Bottom 0.15: 26.25,47.25 v26,47.25
  Bottom 0.2: CON1.11 27.17,46.33 26.25,47.25 | RN3.5 v26,47.25
  Bottom 0.3: J1.75 3.88,42.82 v4.1,42.6
LVDS_TX1_P  (via drill 0.3)
  Top 0.203: v4.1,43.65 4.5,43.65 4.8,43.35 8.3,43.35 arc90 8.45,43.5 8.45,50.45 arc-90 9.5,51.5 10.51,51.5 arc-90 11.42,50.59 11.42,50.31 arc90 11.82,49.91 11.86,49.91 arc90 12.26,50.31 12.26,52.19 arc-90 13.17,53.09 13.2,53.09 arc-90 14.11,52.19 14.11,50.31 arc90 14.51,49.91 14.55,49.91 arc90 14.95,50.31 14.95,52.19 arc-90 15.86,53.09 15.89,53.09 arc-90 16.8,52.19 16.8,50.31 arc90 17.2,49.91 17.24,49.91 arc90 17.64,50.31 17.64,50.59 arc-90 18.55,51.5 25.5,51.5 arc-90 26.75,50.25 26.75,46.25 arc-90 v26.5,46
  Bottom 0.2: CON1.9 26.77,45.73 v26.5,46 26.25,46 25.2,47.05 RN3.6
  Bottom 0.3: J1.73 3.77,43.32 v4.1,43.65
LVDS_TX2_N  (via drill 0.3)
  Top 0.203: v1.2,41 1.55,41.35 7.4,41.35 arc-90 8,40.75 8,39.5 arc90 9,38.5 10.17,38.5 arc90 11.08,39.41 11.08,41.13 arc-90 11.48,41.53 11.52,41.53 arc-90 11.93,41.13 11.93,39.41 arc90 12.84,38.5 12.88,38.5 arc90 13.79,39.41 13.79,40.79 arc-90 14.19,41.2 14.23,41.2 arc-90 14.63,40.79 14.63,39.41 arc90 15.54,38.5 15.59,38.5 arc90 16.49,39.41 16.49,41.13 arc-90 16.9,41.53 16.94,41.53 arc-90 17.34,41.13 17.34,38.91 arc90 18.25,38 23,38 arc90 24,39 24,44.5 arc-90 24.5,45 arc113 v25,45.75
  Bottom 0.2: CON1.5 25.97,45.28 25.5,45.75 v25,45.75 25,46.25 24.4,46.85 RN3.7
  Bottom 0.3: J1.81 1.52,41.32 v1.2,41
LVDS_TX2_P  (via drill 0.3)
  Top 0.203: v1.2,42.1 1.45,41.85 7.4,41.85 arc-90 8.5,40.75 8.5,39.5 arc90 9,39 10.17,39 arc90 10.57,39.41 10.57,41.13 arc-90 11.48,42.03 11.52,42.03 arc-90 12.43,41.13 12.43,39.41 arc90 12.84,39 12.88,39 arc90 13.28,39.41 13.28,41.13 arc-90 14.19,42.03 14.23,42.03 arc-90 15.14,41.13 15.14,39.41 arc90 15.54,39 15.59,39 arc90 15.99,39.41 15.99,41.13 arc-90 16.9,42.03 16.94,42.03 arc-90 17.85,41.13 17.85,38.91 arc90 18.25,38.5 23,38.5 arc90 23.5,39 23.5,45.75 arc-90 v23.8,46.05
  Bottom 0.2: CON1.3 25.57,44.43 25.25,44.75 24.5,44.75 23.8,45.45 v23.8,46.05 23.6,46.25 RN3.8
  Bottom 0.3: J1.79 1.48,41.82 v1.2,42.1
LVDS_TX3_N  (via drill 0.3)
  Top 0.203: v4.1,39.6 4.55,39.6 4.8,39.85 6.05,39.85 arc-90 6.5,39.4 6.5,34.8 arc90 7.37,33.92 8.8,33.92 arc90 9.71,34.83 9.71,35.45 arc-90 10.11,35.85 10.17,35.85 arc-90 10.57,35.45 10.57,34.83 arc90 11.48,33.92 11.54,33.92 arc90 12.45,34.83 12.45,35.45 arc-90 12.85,35.85 12.91,35.85 arc-90 13.32,35.45 13.32,34.83 arc90 14.22,33.92 14.28,33.92 arc90 15.19,34.83 15.19,35.45 arc-90 15.59,35.85 15.65,35.85 arc-90 16.06,35.45 16.06,34.83 arc90 16.96,33.92 17.02,33.92 arc90 17.93,34.83 17.93,35.45 arc-90 18.34,35.85 18.39,35.85 arc-90 18.8,35.45 18.8,34.83 arc90 19.71,33.92 19.77,33.92 arc90 20.67,34.83 20.67,35.45 arc-90 21.08,35.85 21.14,35.85 arc-90 21.54,35.45 21.54,34.83 arc90 22.45,33.92 22.51,33.92 arc90 23.41,34.83 23.41,35.45 arc-90 23.82,35.85 23.88,35.85 arc-90 24.28,35.45 24.28,34.83 arc90 25.19,33.92 26.69,33.92 arc90 27.6,34.83 arc-98 v29.5,36.5
  Bottom 0.15: 29.57,36.57 v29.5,36.5
  Bottom 0.2: CON1.24 29.57,36.57 | RN4.8 29.45,36.45 v29.5,36.5
  Bottom 0.3: J1.87 3.88,39.82 v4.1,39.6
LVDS_TX3_P  (via drill 0.3)
  Top 0.203: v4.1,40.65 4.5,40.65 4.8,40.35 6.05,40.35 arc-90 7,39.4 7,34.8 arc90 7.37,34.43 8.8,34.43 arc90 9.2,34.83 9.2,35.45 arc-90 10.11,36.36 10.17,36.36 arc-90 11.08,35.45 11.08,34.83 arc90 11.48,34.43 11.54,34.43 arc90 11.95,34.83 11.95,35.45 arc-90 12.85,36.36 12.91,36.36 arc-90 13.82,35.45 13.82,34.83 arc90 14.22,34.43 14.28,34.43 arc90 14.69,34.83 14.69,35.45 arc-90 15.59,36.36 15.65,36.36 arc-90 16.56,35.45 16.56,34.83 arc90 16.96,34.43 17.02,34.43 arc90 17.43,34.83 17.43,35.45 arc-90 18.34,36.36 18.39,36.36 arc-90 19.3,35.45 19.3,34.83 arc90 19.71,34.43 19.77,34.43 arc90 20.17,34.83 20.17,35.45 arc-90 21.08,36.36 21.14,36.36 arc-90 22.04,35.45 22.04,34.93 arc90 22.45,34.52 22.51,34.52 arc90 22.91,34.93 22.91,35.45 arc-90 23.82,36.36 23.88,36.36 arc-90 24.79,35.45 24.79,34.83 arc90 25.19,34.43 26.69,34.43 arc90 27.09,34.83 27.09,35.85 arc-90 v28.75,37.5
  Bottom 0.15: 28.65,37.4 v28.75,37.5
  Bottom 0.2: CON1.22 29.17,37.92 v28.75,37.5 | RN4.7 28.65,37.4
  Bottom 0.3: J1.85 3.77,40.32 v4.1,40.65
N$1  (via drill 0.3)
  Top 0.3: 1.8VEN.P$1 71.25,3.75 v68.75,3.75 68.75,8 69.79,9.04 JP3.2 70.29,9 71.75,9 72.25,8.5 72.25,7.25 72.7,6.8 R13.1
  Bottom 0.6: U1.3 70.84,8.45 JP3.2 | R6.2 v68.75,3.75
N$2
  Bottom 0.6: L1.1 75.8,3 U1.5
N$11
  Bottom 0.6: U2.5 54.55,2.75 L2.1
N$12  (via drill 0.3)
  Top 0.3: LED4.A 83.05,4 v81.5,4
  Bottom 0.3: v81.5,4 81.8,3.7 R5.1
N$13
  Bottom 0.2: RN3.3 25.2,52.05 24.6,52.65 Q1.6
N$14  (via drill 0.3)
  Top 0.6: v28.5,8 F2.P$1
  Bottom 0.6: JP2.2 21.59,17.41 23,16 25.5,16 28.5,13 v28.5,8
N$15
  Bottom 0.2: RN3.4 26,51.75 26.75,52.5 26.75,55.15 26.45,55.45 Q1.3
N$16
  Bottom 0.2: RN2.1 28.15,52.1 27.85,52.4 Q2.6
N$17
  Bottom 0.2: RN2.2 28.95,51.45 30,52.5 30,54.25 29.15,55.1 Q2.3
N$18
  Bottom 0.2: RN2.3 29.75,51.75 30.85,52.85 Q3.6
N$19
  Bottom 0.2: RN2.4 30.55,51.3 31.25,52 32.5,52 33,52.5 33,54.85 Q3.3
N$20
  Bottom 0.2: RN3.1 23.6,51.3 23.3,51.6 22.1,51.6 21.55,52.15 Q4.6
N$21
  Bottom 0.2: RN3.2 24.4,52.3 23.7,53 23.7,54.6 Q4.3
N$22
  Top 0.6: JP1.2 21.59,10.71 29.3,3 F1.P$1
N$23
  Bottom 0.6: U1.4 75.85,8.5 R2.1 R1.2
N$24
  Bottom 0.2: RN4.2 28.65,32.25 29,31.9 32.4,31.9 32.85,32.35 Q5.6
N$25
  Bottom 0.2: RN4.1 30,33.4 30.3,33.7 30.3,34.6 30.55,34.85 Q5.3
N$26
  Bottom 0.6: R3.2 R4.1 56.25,7.95 U2.4
N$27
  Top 1: 12V.1 72.43,58.42 45.72,58.42 40.64,53.34 40.64,15.24 38.1,12.7 JP1.3
N$28
  Top 1: 3.3V.1 38.1,22.86 34.29,19.05 JP2.3
N$29  (via drill 0.3)
  Top 0.3: LED3.A 68.52,73.48 v68.52,74.85
  Bottom 0.3: v68.52,74.85 68.58,74.79 R8.1
N$30  (via drill 0.3)
  Top 0.3: 62.05,1.75 LED2.A 61.55,1.25 v60.5,1.25
  Bottom 0.3: R9.1 61.45,1.25 v60.5,1.25
N$31  (via drill 0.3)
  Top 0.3: LED1.A 73.68,73.44 v73.68,74.85
  Bottom 0.3: v73.68,74.85 73.66,74.83 R11.1
N$32  (via drill 0.3)
  Top 0.3: LED4.C 83.3,1.75 v84.75,1.75
  Bottom 0.3: Q6.3 85.5,2.5 v84.75,1.75
N$33
  cutout Route15: 18.8,39.88 22.61,39.88 22.61,49.02 18.8,49.02
  cutout Route2: 18.8,39.88 22.61,39.88 22.61,49.02 18.8,49.02

### Text on the board
Top: 1 | REV A
Route2: 2
Route15: 3
Bottom: 4
tPlace: 3.3V | 12V | GND | GND | HSMC-IPHONE4 DISPLAY BRIDGE | (C) 2014 MIXDOWN ENGINEERING | HTTP://MIXDOWN.CA | GND | GND | CC BY-NC-SA | 5V | EN5 | EN18 | 1.8V